# Altium schematic sheet LPCB220 - THROTTLE MUX TOP.SchDoc
size A3; Address1: Factory 10; Address2: 9-13 Dingley Avenue, Dandeong, VICTORIA 3175, AUSTRALIA; DocumentNumber: 15; Revision: 1; SheetNumber: 15; SheetTotal: 18; Lockie__PCB_SUB_ASSEMBLY: Throttle Multiplexers; Lockie__PCB_ASSEMBLY: Brake Control; Lockie__LDL: LPCB220; Lockie__PCB_DESCRIPTION: Redundant Stepper Node
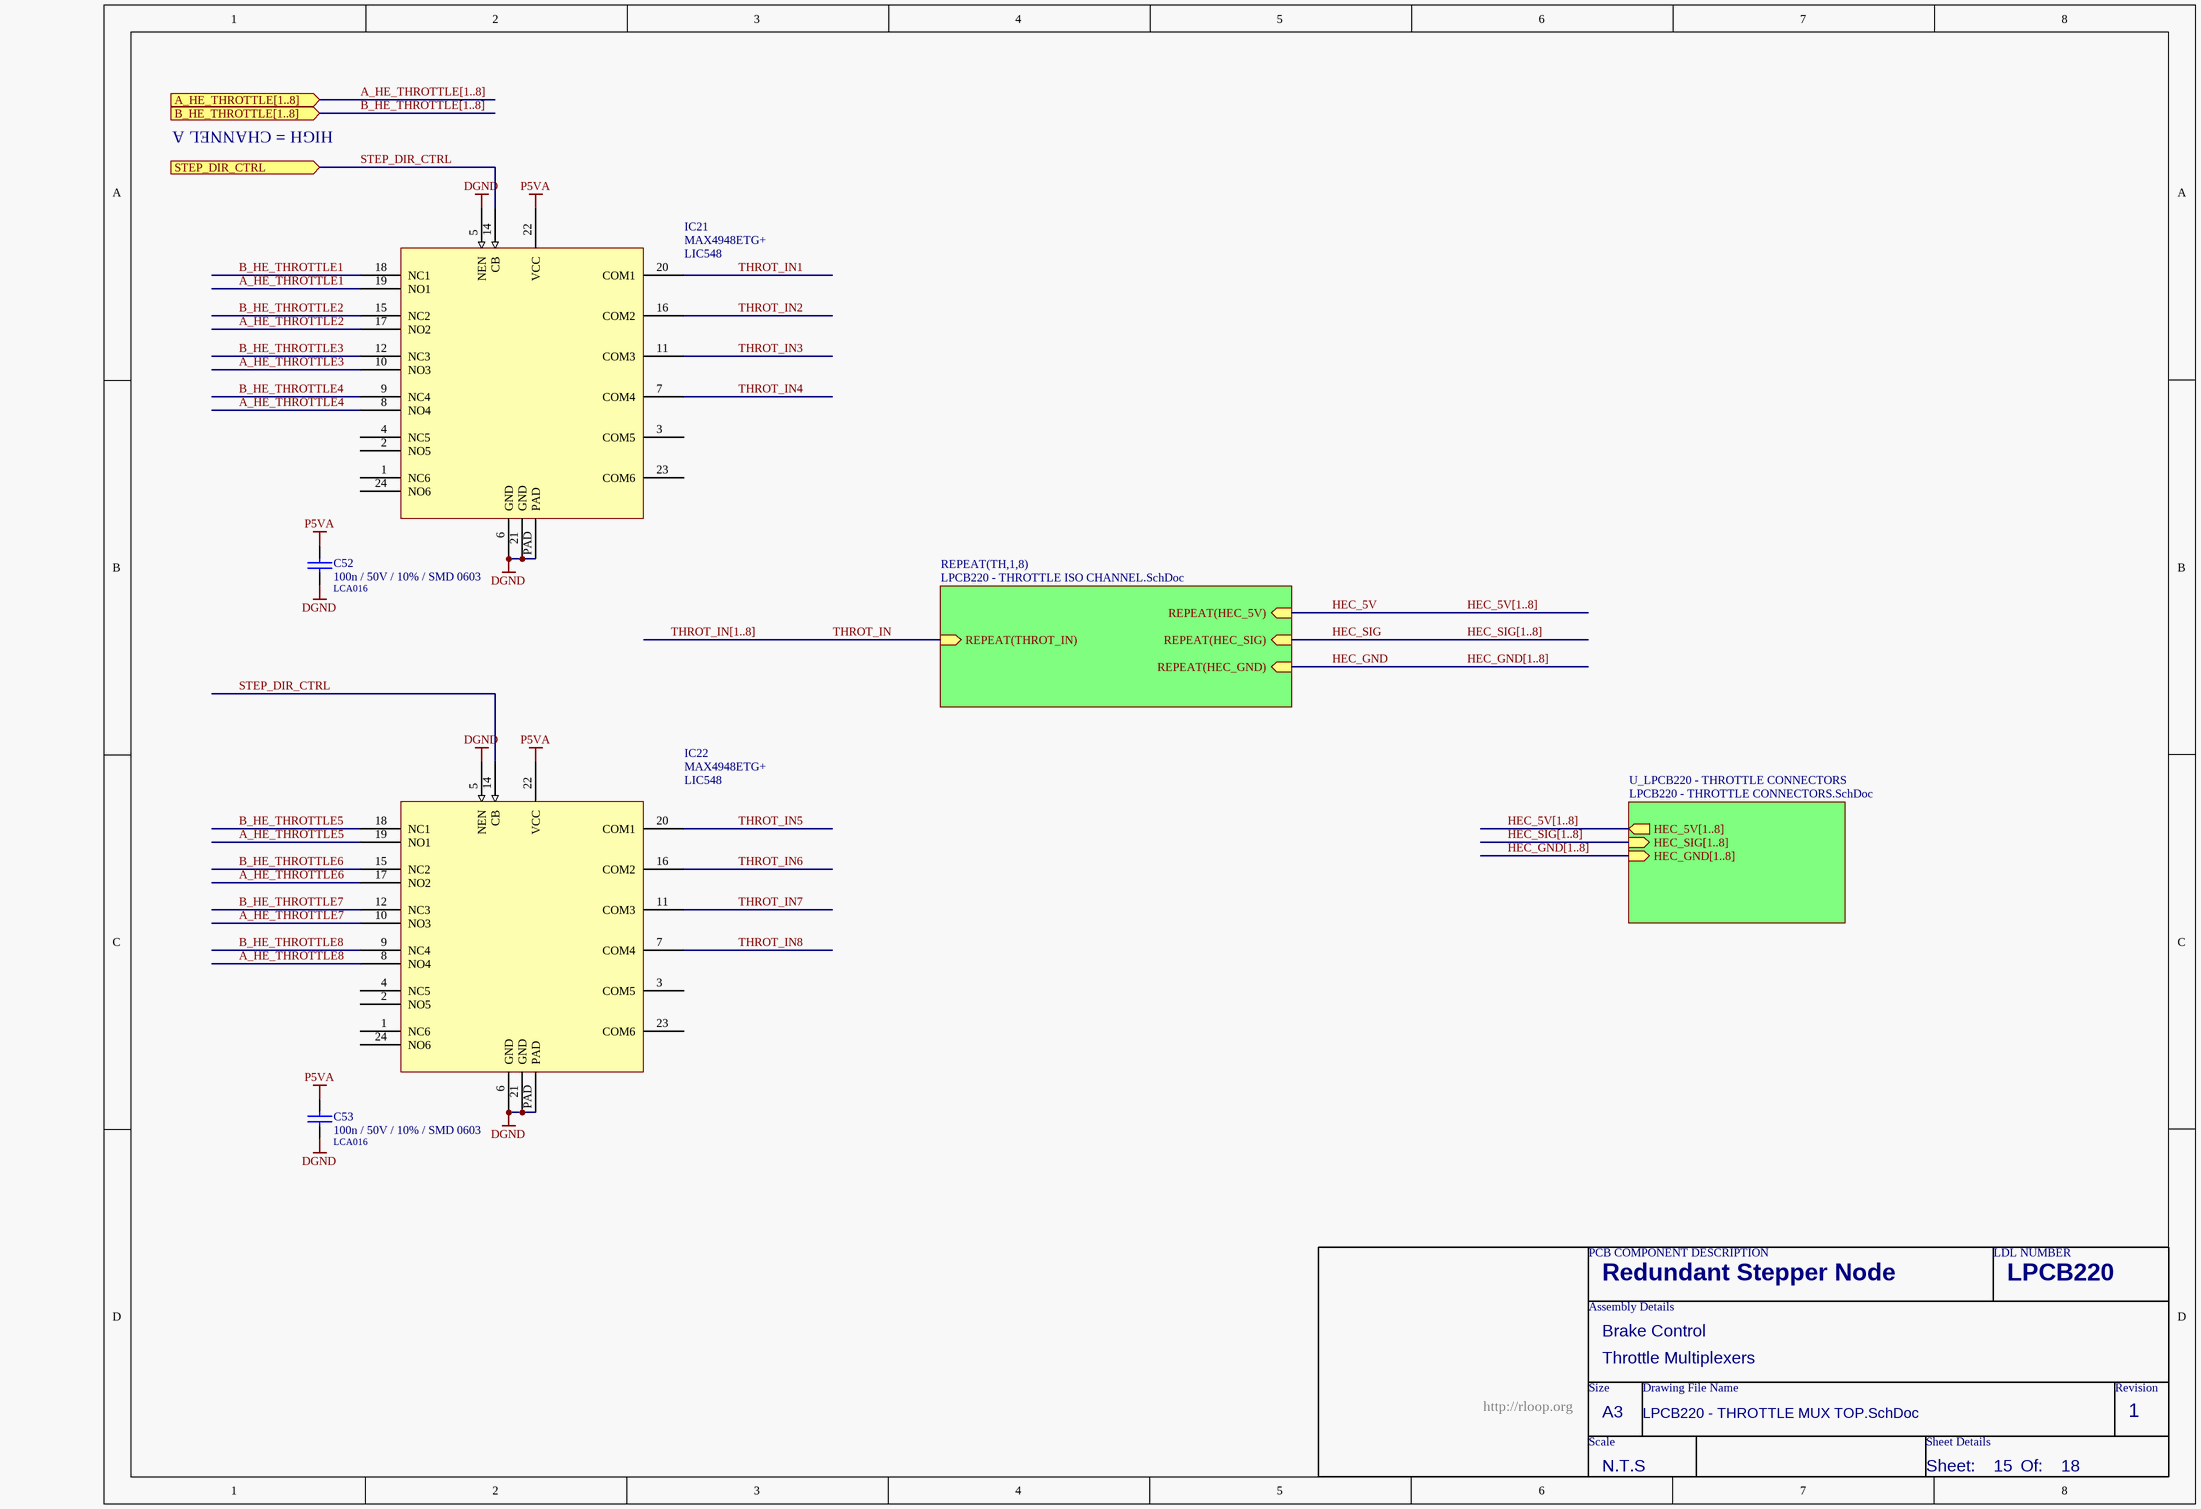
[diagram p0: LPCB220 - THROTTLE MUX TOP.SchDoc]

## Parts
C52  100n / 50V / 10% / SMD 0603  LDL_NUMBER: LCA016  [LFP011__CC1608-0603-IPC7351_B]
C53  100n / 50V / 10% / SMD 0603  LDL_NUMBER: LCA016  [LFP011__CC1608-0603-IPC7351_B]
IC21  MAX4948ETG+  LDL_NUMBER: LIC548  [LFP095__QFN127P600-8N]
IC22  MAX4948ETG+  LDL_NUMBER: LIC548  [LFP095__QFN127P600-8N]

## Sub-sheets
REPEAT(TH,1,8) = LPCB220 - THROTTLE ISO CHANNEL.SchDoc: REPEAT(THROT_IN) (in), REPEAT(HEC_5V) (in), REPEAT(HEC_GND) (in), REPEAT(HEC_SIG) (in)
U_LPCB220 - THROTTLE CONNECTORS = LPCB220 - THROTTLE CONNECTORS.SchDoc: HEC_5V[1..8] (out), HEC_SIG[1..8] (in), HEC_GND[1..8] (in)

## Ports
A_HE_THROTTLE[1..8] (in), B_HE_THROTTLE[1..8] (in), STEP_DIR_CTRL (in)

## Nets
DGND: C52.2 C53.2 IC21.5(NEN) IC21.6(GND) IC21.21(GND) IC21.PAD IC22.5(NEN) IC22.6(GND) IC22.21(GND) IC22.PAD
P5VA: C52.1 C53.1 IC21.22(VCC) IC22.22(VCC)
A_HE_THROTTLE1: IC21.19(NO1)
A_HE_THROTTLE2: IC21.17(NO2)
A_HE_THROTTLE3: IC21.10(NO3)
A_HE_THROTTLE4: IC21.8(NO4)
A_HE_THROTTLE5: IC22.19(NO1)
A_HE_THROTTLE6: IC22.17(NO2)
A_HE_THROTTLE7: IC22.10(NO3)
A_HE_THROTTLE8: IC22.8(NO4)
B_HE_THROTTLE1: IC21.18(NC1)
B_HE_THROTTLE2: IC21.15(NC2)
B_HE_THROTTLE3: IC21.12(NC3)
B_HE_THROTTLE4: IC21.9(NC4)
B_HE_THROTTLE5: IC22.18(NC1)
B_HE_THROTTLE6: IC22.15(NC2)
B_HE_THROTTLE7: IC22.12(NC3)
B_HE_THROTTLE8: IC22.9(NC4)
HEC_5V: sheet REPEAT(TH,1,8)/REPEAT(HEC_5V)
HEC_GND: sheet REPEAT(TH,1,8)/REPEAT(HEC_GND)
HEC_SIG: sheet REPEAT(TH,1,8)/REPEAT(HEC_SIG)
STEP_DIR_CTRL: IC21.14(CB) IC22.14(CB) ; port STEP_DIR_CTRL
THROT_IN: sheet REPEAT(TH,1,8)/REPEAT(THROT_IN)
THROT_IN1: IC21.20(COM1)
THROT_IN2: IC21.16(COM2)
THROT_IN3: IC21.11(COM3)
THROT_IN4: IC21.7(COM4)
THROT_IN5: IC22.20(COM1)
THROT_IN6: IC22.16(COM2)
THROT_IN7: IC22.11(COM3)
THROT_IN8: IC22.7(COM4)

Not connected (* = marked no-connect by the designer): IC21 1(NC6) 2(NO5) 3(COM5) 4(NC5) 23(COM6) 24(NO6); IC22 1(NC6) 2(NO5) 3(COM5) 4(NC5) 23(COM6) 24(NO6)

## Buses and harness runs
bus A_HE_THROTTLE[1..8] = port A_HE_THROTTLE[1..8]
bus B_HE_THROTTLE[1..8] = port B_HE_THROTTLE[1..8]
bus HEC_5V[1..8]
bus HEC_5V[1..8] = sheet U_LPCB220 - THROTTLE CONNECTORS/HEC_5V[1..8]
bus HEC_GND[1..8]
bus HEC_GND[1..8] = sheet U_LPCB220 - THROTTLE CONNECTORS/HEC_GND[1..8]
bus HEC_SIG[1..8]
bus HEC_SIG[1..8] = sheet U_LPCB220 - THROTTLE CONNECTORS/HEC_SIG[1..8]
bus THROT_IN[1..8]

## Notes on the sheet
- HIGH = CHANNEL A
- PCB COMPONENT DESCRIPTION
- LDL NUMBER
- Assembly Details
- Size
- Drawing File Name
- Revision
- http://rloop.org
- Scale
- A3
- Sheet Details
- N.T.S
- Sheet:
- Of:

## Library data of the parts
C52 C53 = 100n / 50V / 10% / SMD 0603: Capacitor, Ceramic Chip, 100nF (0.1uF), 50V, 5%, SMD 0603 [LCA016]; FMEDA__OPERATING__VOLTAGE_MIN: 0; FMEDA__OPERATING__VOLTAGE_MAX: 3.3; FMEDA__OPERATING__TEMP_MIN: -20; FMEDA__OPERATING__TEMP_TYP: 27; FMEDA__OPERATING__TEMP_MAX: 50; FMEDA__CHANNEL: COM; Value: 100n; FMEDA__FUNCTION_IN_SYSTEM: *; FMEDA__OPERATING__VOLTAGE_TYP: 3.3
IC21 IC22 = MAX4948ETG+: IC, Analog Switch, SMD [LIC548]